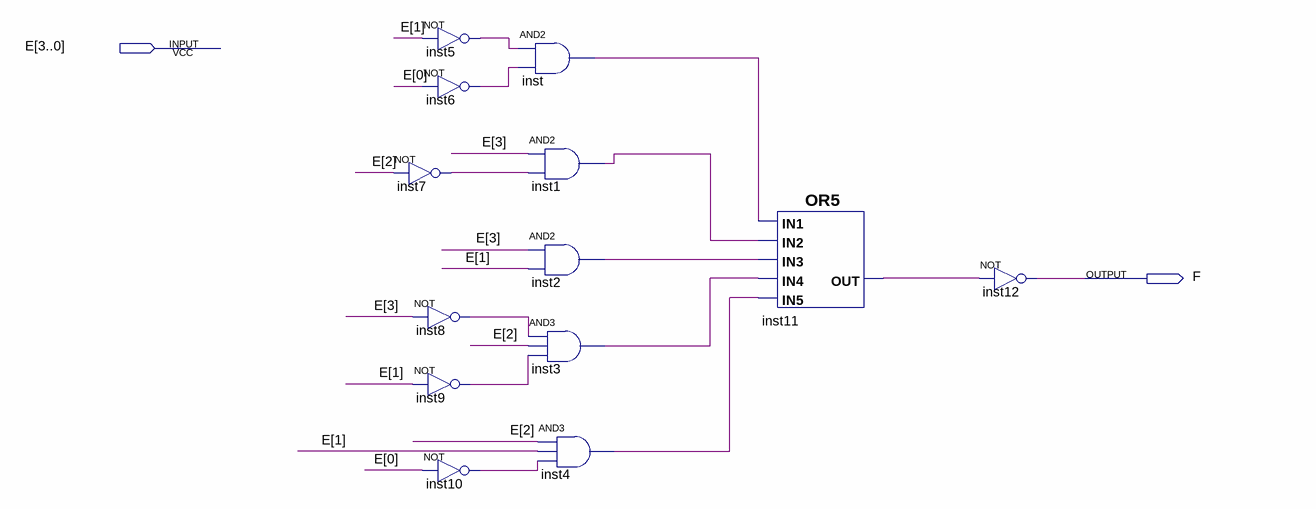
[diagram p0: schematic sheet]
// Quartus schematic F.bdf as structural Verilog: 13 symbols, 2 pins
module F (
  input  [3:0] E,
  output F
);

  wire inst1_out, inst2_out, inst3_out, inst4_out, inst5_out, inst6_out, inst7_out, inst8_out, inst9_out,
       inst10_out, inst11_out, inst_out;

  not inst5 (inst5_out, E[1]);
  not inst6 (inst6_out, E[0]);
  not inst7 (inst7_out, E[2]);
  not inst8 (inst8_out, E[3]);
  not inst9 (inst9_out, E[1]);
  not inst10 (inst10_out, E[0]);
  and inst (inst_out, inst5_out, inst6_out);
  and inst1 (inst1_out, E[3], inst7_out);
  and inst2 (inst2_out, E[3], E[1]);
  and inst3 (inst3_out, inst8_out, E[2], inst9_out);
  and inst4 (inst4_out, E[2], E[1], inst10_out);
  or inst11 (inst11_out, inst_out, inst1_out, inst2_out, inst3_out, inst4_out);
  not inst12 (F, inst11_out);
endmodule
